# EasyEDA Pro project ProProject_Buck-Boost_1_2024-04-08.epro

# Schematic Schematic1
Create Date: 2024-04-07; Page Name: P1; Project Name: Buck-Boost_1; Schematic Name: Schematic1; Update Date: 2024-04-07; Company: 嘉立创EDA; Page Size: A3; Version: V1.0
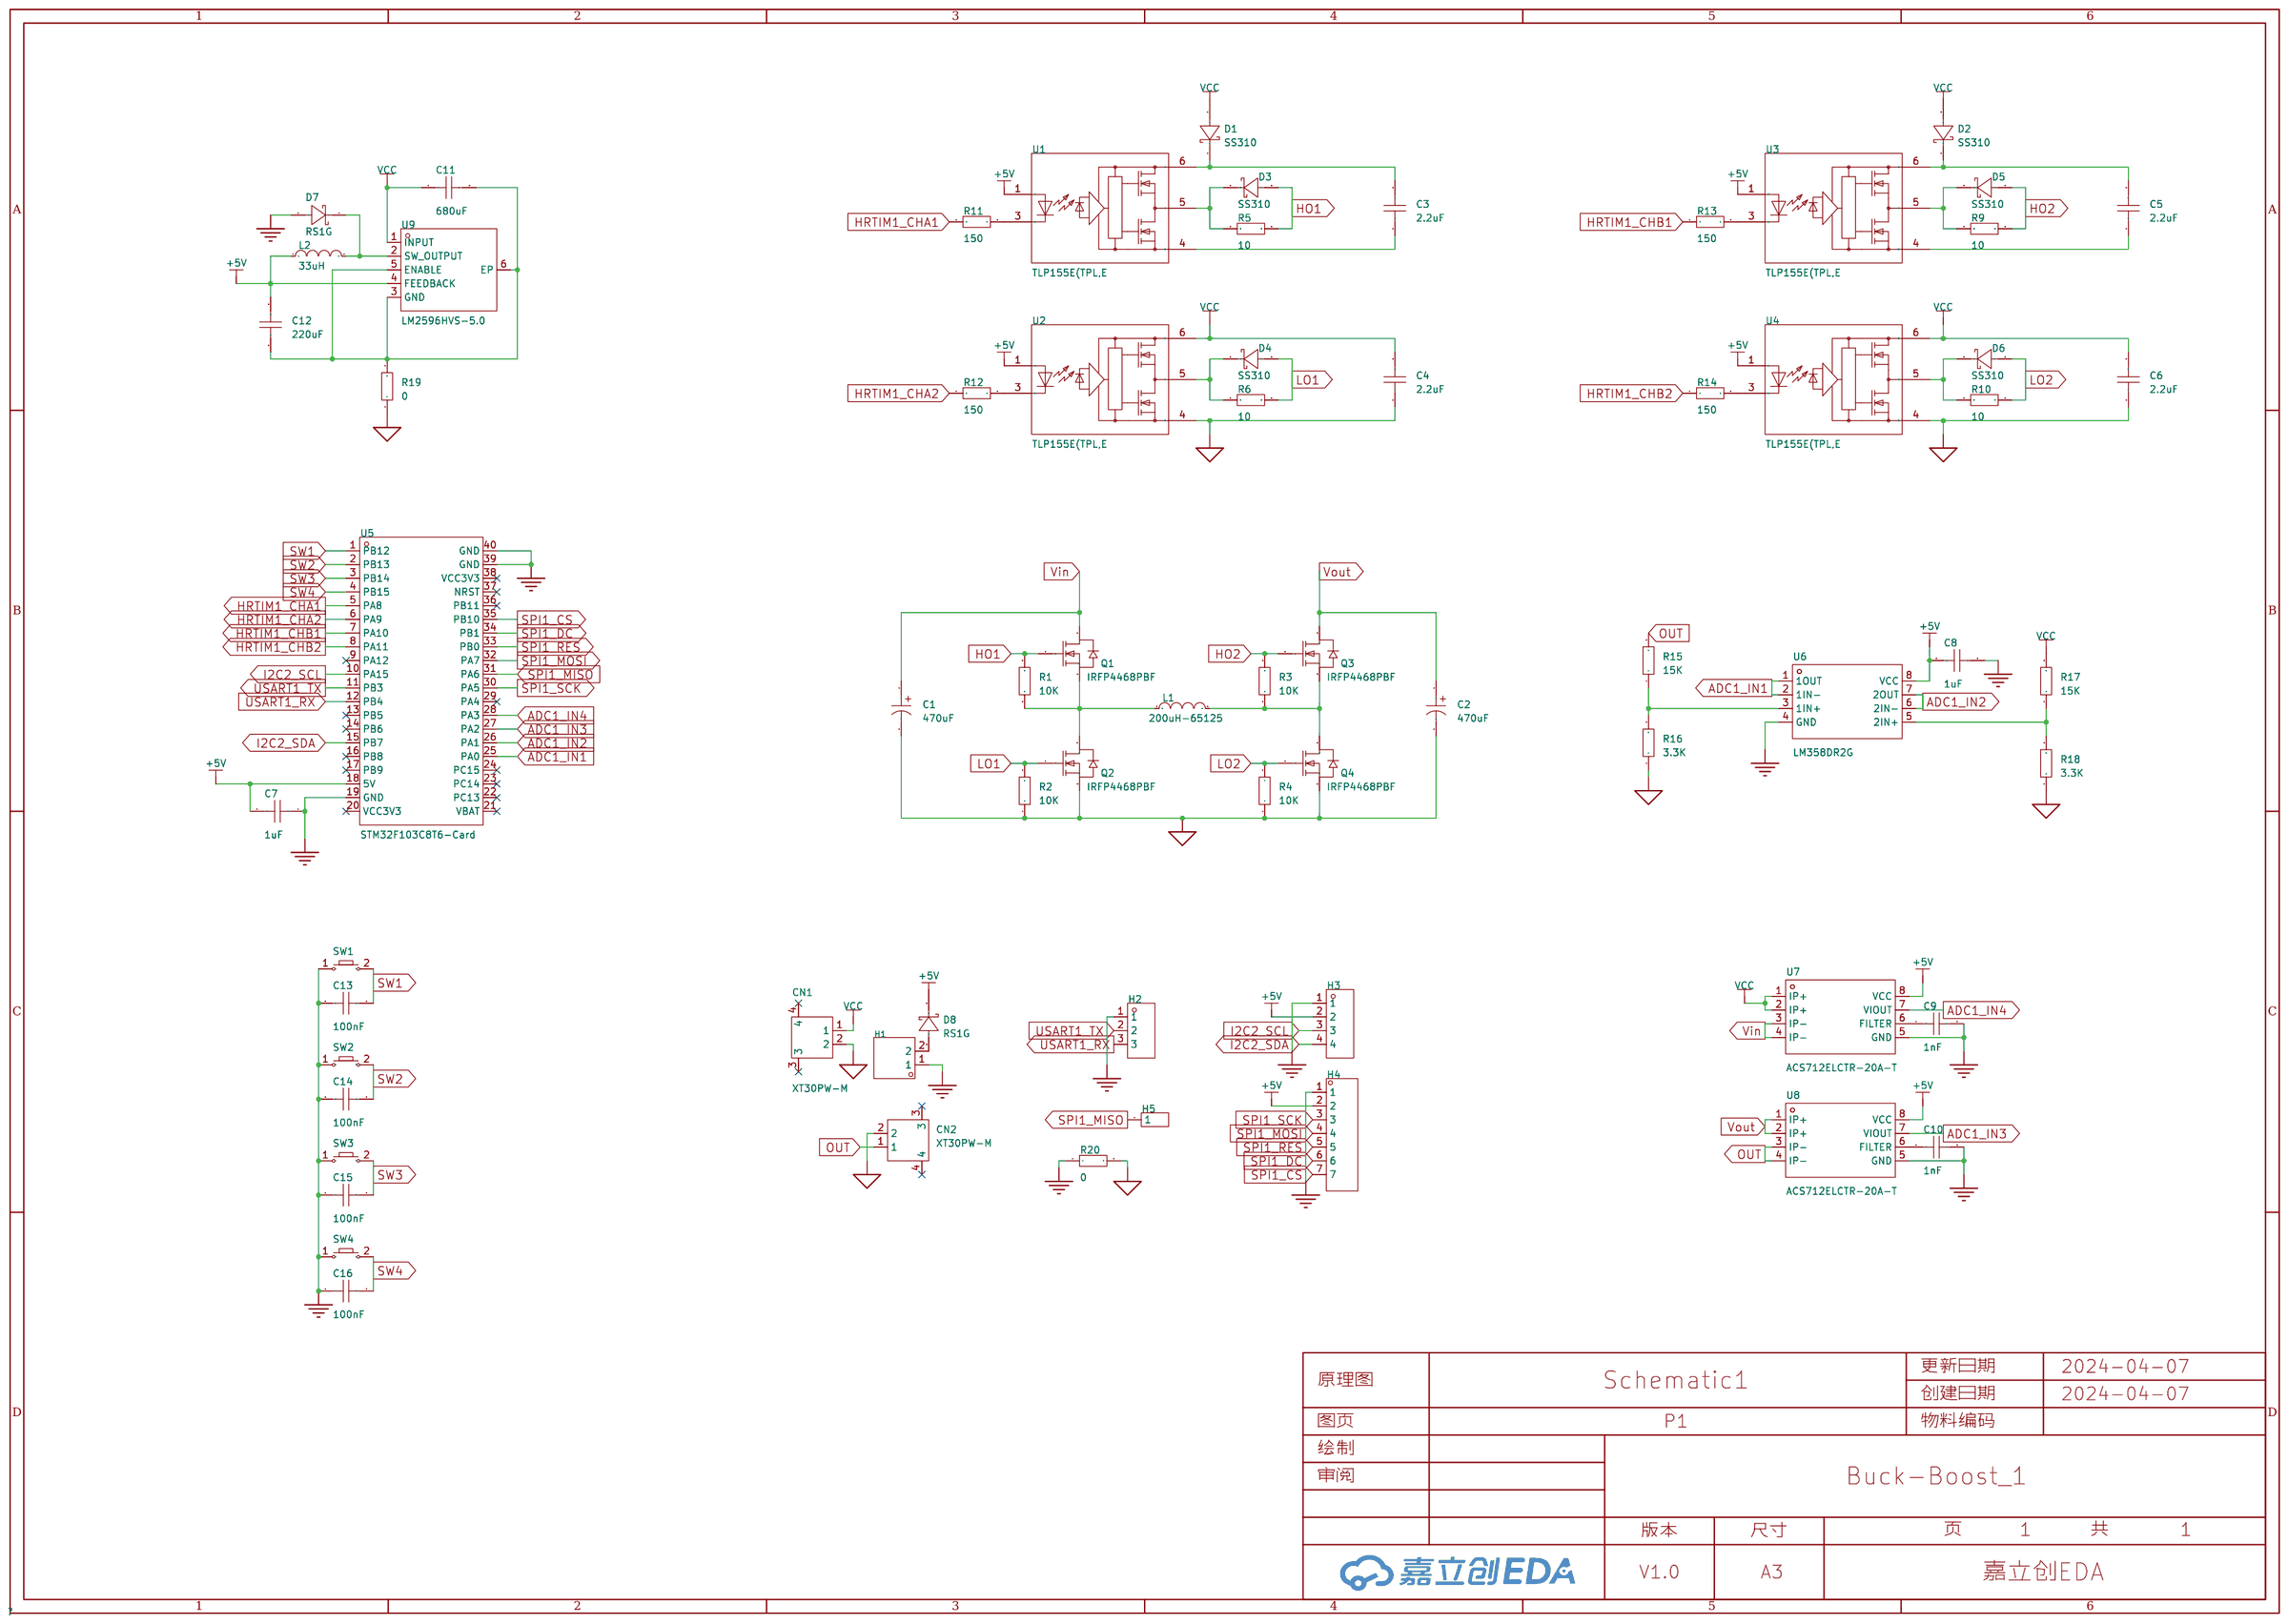
[diagram p0: schematic sheet]

## Parts
C1  470uF  [CAP-TH_BD16.0-P7.50-D1.5-FD]
C2  470uF  [CAP-TH_BD16.0-P7.50-D1.5-FD]
C3  2.2uF  [C0603]
C4  2.2uF  [C0603]
C5  2.2uF  [C0603]
C6  2.2uF  [C0603]
C7  1uF  [C0603]
C8  1uF  [C0603]
C9  1nF  [C0603]
C10  1nF  [C0603]
C11  680uF  [C0603]
C12  220uF  [C0603]
C13  100nF  [C0603]
C14  100nF  [C0603]
C15  100nF  [C0603]
C16  100nF  [C0603]
CN1  XT30PW-M  [CONN-TH_XT30PW-M]
CN2  XT30PW-M  [CONN-TH_XT30PW-M]
D1  SS310  [SMA_L4.3-W2.6-LS5.2-RD]
D2  SS310  [SMA_L4.3-W2.6-LS5.2-RD]
D3  SS310  [SMA_L4.3-W2.6-LS5.2-RD]
D4  SS310  [SMA_L4.3-W2.6-LS5.2-RD]
D5  SS310  [SMA_L4.3-W2.6-LS5.2-RD]
D6  SS310  [SMA_L4.3-W2.6-LS5.2-RD]
D7  RS1G  [SMA_L4.3-W2.6-LS5.0-RD]
D8  RS1G  [SMA_L4.3-W2.6-LS5.0-RD]
H1  -  [HDR-TH_2P-P2.54-V-M-1]
H2  -  [HDR-TH_3P-P2.54-V-M]
H3  -  [HDR-TH_4P-P2.54-V-F]
H4  -  [HDR-TH_7P-P2.54-V-F]
H5  -  [HDR-TH_1P-V-M_XKB_X4611WV-01I-C28D40]
L1  200uH-65125  [IND-TH_200UH-65125]
L2  33uH  [IND-SMD_L7.3-W6.7_TMPA0605SV]
Q1  IRFP4468PBF  [TO-247AC-3_L15.8-W5.0-P5.46-L]
Q2  IRFP4468PBF  [TO-247AC-3_L15.8-W5.0-P5.46-L]
Q3  IRFP4468PBF  [TO-247AC-3_L15.8-W5.0-P5.46-L]
Q4  IRFP4468PBF  [TO-247AC-3_L15.8-W5.0-P5.46-L]
R1  10K  [R0603]
R2  10K  [R0603]
R3  10K  [R0603]
R4  10K  [R0603]
R5  10  [R0603]
R6  10  [R0603]
R9  10  [R0603]
R10  10  [R0603]
R11  150  [R0603]
R12  150  [R0603]
R13  150  [R0603]
R14  150  [R0603]
R15  15K  [R0603]
R16  3.3K  [R0603]
R17  15K  [R0603]
R18  3.3K  [R0603]
R19  0  [R0603]
R20  0  [R0603]
SW1  -  [Key_SMD_3x4x2]
SW2  -  [Key_SMD_3x4x2]
SW3  -  [Key_SMD_3x4x2]
SW4  -  [Key_SMD_3x4x2]
U1  TLP155E(TPL,E  [OPTO-SMD-5_L3.7-W4.6-P1.27-LS7.0-BR]
U2  TLP155E(TPL,E  [OPTO-SMD-5_L3.7-W4.6-P1.27-LS7.0-BR]
U3  TLP155E(TPL,E  [OPTO-SMD-5_L3.7-W4.6-P1.27-LS7.0-BR]
U4  TLP155E(TPL,E  [OPTO-SMD-5_L3.7-W4.6-P1.27-LS7.0-BR]
U5  STM32F103C8T6-Card  [CONN-TH_L53.3-W22.9_STM32F103C8T6-CARD]
U6  LM358DR2G  [SOIC-8_L5.0-W4.0-P1.27-LS6.0-BL]
U7  ACS712ELCTR-20A-T  [SOIC-8_L4.9-W3.9-P1.27-LS6.0-BL]
U8  ACS712ELCTR-20A-T  [SOIC-8_L4.9-W3.9-P1.27-LS6.0-BL]
U9  LM2596HVS-5.0  [TO-263-5_L10.0-W9.0-P1.70-LS15.0-BL]

## Library data of the parts
C1 C2 = ERS2BM471L35OT: 容值:470uF;精度:±20%;额定电压:120V;纹波电流:-;等效串联电阻:-;; LCSC Part Name: 470uF ±20% 120V; Supplier Part: C724648; Manufacturer: AISHI(艾华集团); Supplier Footprint: 插件,D16xL35mm; JLCPCB Part Class: 扩展库; Datasheet: https://atta.szlcsc.com/upload/public/pdf/source/20191015/C438940_4B8E60A742BB0AE40DDEF87A5C89089D.pdf; Supplier: LCSC; Tolerance: ±20%; Rated Voltage: 120V
C3-C16 = CAP_0603: Supplier Footprint: 0603
CN1 CN2 = XT30PW-M: 类别:-;类型1:-;; LCSC Part Name: AMASS(艾迈斯)航模插头 卧式弯脚 XT30PW-M公头; Supplier Part: C431092; Manufacturer: AMASS(艾迈斯); JLCPCB Part Class: 扩展库; Datasheet: https://atta.szlcsc.com/upload/public/pdf/source/20220222/6A9F22F7850E25B33E1BE430ADF8560B.pdf; Supplier: LCSC; Brand: 艾迈斯; Type: 航模插头; RatedVoltage: DC 500V; InterfaceType: 公头; RatedCurrent: 15A; RecommendedWireGauge: 16/18/20AWG; contact resistance: 1.2mΩ; specifications: 2pin
D1-D6 = SS310_C15874: 正向压降(Vf):850mV@3A;直流反向耐压(Vr):100V;平均整流电流(Io):3A;; LCSC Part Name: 电压:100V 电流:3A; Supplier Part: C15874; Manufacturer: MDD; Supplier Footprint: SMA(DO-214AC); JLCPCB Part Class: Extended Part; Datasheet: https://atta.szlcsc.com/upload/public/pdf/source/20230314/A80AE34493C69B89E2F4B1712F433538.pdf; Supplier: LCSC; Forward Voltage (Vf@If): 850mV@3A; Reverse Voltage (Vr): 100V; Average Rectified Current (Io): 3A; Reverse Leakage Current (Ir): 500uA@100V; Reverse Leakage Current: 5uA; Reverse Recovery Time (trr): 150ns; Operating Temperature: -55℃~+150℃; Diode Configuration: 独立式
D7 D8 = RS1G_C18199117: 二极管配置:独立式;正向压降(Vf):1.3V@1.0A;直流反向耐压(Vr):400V;平均整流电流(Io):1A;反向恢复时间(trr):150ns;; LCSC Part Name: 电压:400V 电流:1A; Supplier Part: C18199117; Manufacturer: 宏迦橙; Supplier Footprint: SMA(DO-214AC); JLCPCB Part Class: Extended Part; Datasheet: https://atta.szlcsc.com/upload/public/pdf/source/20230925/2DA11C666C5D1E1EAD04936CEF3A63C9.pdf; Supplier: LCSC; Diode Configuration: 独立式; Forward Voltage (Vf@If): 1.3V@1.0A; Reverse Voltage (Vr): 400V; Average Rectified Current (Io): 1A; Reverse Leakage Current: 5uA@400V; Reverse Recovery Time (trr): 150ns; Operating Temperature: -55℃~+150℃; Reverse Leakage Current (Ir): 500uA@100V
H1 = HDR-M_2.54_1x2P: Supplier Part: C124375; Supplier Footprint: 插件
H2 = HDR-M_2.54_1x3P: Supplier Part: C2937625; Supplier Footprint: 插件
H3 = HDR-F_2.54_1x4P: Supplier Part: C2718488; Supplier Footprint: 插件
H4 = HDR-F_2.54_1x7P: Supplier Part: C124418; Supplier Footprint: 插件
H5 = HDR-M_2.54_1x1P: Supplier Part: C81276; Supplier Footprint: 插件; JLCPCB Part Class: Extended Part
L1 = 200uH-65125: Supplier Part: C9900012734; Supplier Footprint: IND-TH; JLCPCB Part Class: Extended Part; Supplier: LCSC
L2 = MGV0603330M-10: 电感值:33uH;精度:±20%;额定电流:2A;饱和电流(Isat):2.5A;类型:-;; LCSC Part Name: 33uH ±20% 2.5A; Supplier Part: C2453970; Manufacturer: Laird-Signal Integrity Products; JLCPCB Part Class: Extended Part; Datasheet: https://atta.szlcsc.com/upload/public/pdf/source/20210416/42953FF7012EE029E7A94AFFA1C1F7D2.pdf; Supplier: LCSC; Tolerance: ±20%; Rated Current: 2A; Saturation Current (Isat): 2.5A; DC Resistance (DCR): 200mΩ
Q1-Q4 = IRFP4468PBF: 类型:N沟道;漏源电压(Vdss):100V;连续漏极电流(Id):195A;功率(Pd):520W;导通电阻(RDS(on)@Vgs,Id):2.6mΩ@10V,180A;阈值电压(Vgs(th)@Id):4V@250uA;; LCSC Part Name: N沟道 耐压:100V 电流:195A; Supplier Part: C2919; Manufacturer: Infineon(英飞凌); Supplier Footprint: TO-247AC-3; JLCPCB Part Class: 扩展库; Datasheet: https://atta.szlcsc.com/upload/public/pdf/source/20200421/C513172_0206954A6A294F6A4994DAF9F319B5AC.pdf; Supplier: LCSC; Type: N沟道; Drain Source Voltage (Vdss): 100V; Continuous Drain Current (Id): 195A; Power Dissipation (Pd): 520W; Drain Source On Resistance (RDS(on)@Vgs,Id): 2.6mΩ@10V,180A; Gate Threshold Voltage (Vgs(th)@Id): 4V@250uA; Total Gate Charge (Qg@Vgs): 540nC@10V; Input Capacitance (Ciss@Vds): 19.86nF@50V; Operating Temperature: -55℃~+175℃@(Tj)
R1-R6 R9-R20 = Res_0603: Supplier Footprint: 0603
SW1-SW4 = Key_SMD_3x4x2: Supplier Footprint: SMD
U1-U4 = TLP155E(TPL,E: 输入类型:DC;电源电压:10V~30V;共模瞬变抗扰度CMTI:15kV/us;传播延迟tpLH/tpHL:170ns；170ns;; Supplier Part: C56499; Manufacturer: TOSHIBA(东芝); Supplier Footprint: SOIC-5-4.6mm; JLCPCB Part Class: 扩展库; Datasheet: https://atta.szlcsc.com/upload/public/pdf/source/20150821/1457707350132.pdf; Supplier: LCSC; Input Type: DC; Supply Voltage: 10V~30V; Common Mode Transient Immunity (CMTI): 15kV/us; Propagation Delay tpLH/tpHL: 170ns；170ns; Number of Channels: 1; Operating Temperature: -40℃~+100℃
U5 = STM32F103C8T6-Card: Supplier Part: C9900077949; Supplier Footprint: 插件; Supplier: LCSC
U6 = LM358DR2G: 放大器数:双路;增益带宽积(GBP):1MHz;输入偏置电流(Ib):45nA;压摆率(SR):-;带宽(-3db):-;; LCSC Part Name: LM358DR2G 运算放大器，单电源，双路; Supplier Part: C7950; Manufacturer: onsemi(安森美); Supplier Footprint: SOIC-8; JLCPCB Part Class: 基础库; Datasheet: https://atta.szlcsc.com/upload/public/pdf/source/20150124/1457707258826.pdf; Supplier: LCSC; Number of Circuits: 双路; Gain Bandwidth Product(GBP): 1MHz; Current - Input Bias(Ib): 45nA; Output Current: 40mA; Supply Current: 1.5mA; Operating Temperature: 0℃~+70℃
U7 U8 = ACS712ELCTR-20A-T: 电流测量范围:20A;灵敏度:100mV/A;; Supplier Part: C10681; Manufacturer: ALLEGRO(美国埃戈罗); Supplier Footprint: SOIC-8; JLCPCB Part Class: 扩展库; Datasheet: https://atta.szlcsc.com/upload/public/pdf/source/20130706/1457706622210.pdf; Supplier: LCSC; Current Range: 20A; Supply Voltage: 5V; Sensitivity: 100mV/A; Operating Temperature: -40℃~+85℃
U9 = LM2596HVS-5.0_C18197847: Supplier Part: C18197847; Manufacturer: TECH PUBLIC(台舟); Supplier Footprint: TO-263-5L; Datasheet: https://atta.szlcsc.com/upload/public/pdf/source/20231008/EF2B5CCB8589235E578FFA43C9351D8A.pdf; Supplier: LCSC

## Nets
+5V: C7.2 C8.1 C12.2 D8.1(K) H3.2 H4.2 L2.1 U1.1(AN) U2.1(AN) U3.1(AN) U4.1(AN) U5.18(5V) U6.8(VCC) U7.8(VCC) U8.8(VCC) U9.4(FEEDBACK)
AGND: C1.2 C2.2 C4.1 C6.1 CN1.2 CN2.2 Q2.3(S) Q4.3(S) R2.1 R4.1 R16.1 R18.1 R19.1 R20.2 U2.4(GND) U4.4(GND)
GND: C7.1 C8.2 C9.2 C10.2 C13.1 C14.1 C15.1 C16.1 D7.2(A) H1.1 H2.1 H3.1 H4.1 R20.1 SW1.1 SW2.1 SW3.1 SW4.1 U5.19(GND) U5.39(GND) U5.40(GND) U6.4(GND) U7.5(GND) U8.5(GND)
VCC: C4.2 C6.2 C11.1 CN1.1 D1.2(A) D2.2(A) R17.2 U2.6(VCC) U4.6(VCC) U7.1(IP+) U7.2(IP+) U9.1(INPUT)
Vin: C1.1 Q1.2(D) U7.3(IP-) U7.4(IP-)
ADC1_IN1: U5.25(PA0) U6.1(1OUT) U6.2(1IN-)
ADC1_IN2: U5.26(PA1) U6.6(2IN-) U6.7(2OUT)
ADC1_IN3: U5.27(PA2) U8.7(VIOUT)
ADC1_IN4: U5.28(PA3) U7.7(VIOUT)
HO1: D3.2(A) Q1.1(G) R1.2 R5.2
HO2: D5.2(A) Q3.1(G) R3.2 R9.2
HRTIM1_CHA1: R11.1 U5.5(PA8)
HRTIM1_CHA2: R12.1 U5.6(PA9)
HRTIM1_CHB1: R13.1 U5.7(PA10)
HRTIM1_CHB2: R14.1 U5.8(PA11)
I2C2_SCL: H3.3 U5.10(PA15)
I2C2_SDA: H3.4 U5.15(PB7)
LO1: D4.2(A) Q2.1(G) R2.2 R6.2
LO2: D6.2(A) Q4.1(G) R4.2 R10.2
OUT: CN2.1 R15.2 U8.3(IP-) U8.4(IP-)
SPI1_CS: H4.7 U5.35(PB10)
SPI1_DC: H4.6 U5.34(PB1)
SPI1_MISO: H5.1 U5.31(PA6)
SPI1_MOSI: H4.4 U5.32(PA7)
SPI1_RES: H4.5 U5.33(PB0)
SPI1_SCK: H4.3 U5.30(PA5)
SW1: C13.2 SW1.2 U5.1(PB12)
SW2: C14.2 SW2.2 U5.2(PB13)
SW3: C15.2 SW3.2 U5.3(PB14)
SW4: C16.2 SW4.2 U5.4(PB15)
USART1_RX: H2.3 U5.12(PB4)
USART1_TX: H2.2 U5.11(PB3)
Vout: C2.1 Q3.2(D) U8.1(IP+) U8.2(IP+)
$1N1235: D4.1(K) R6.1 U2.5(VO)
$1N1253: D3.1(K) R5.1 U1.5(VO)
$1N1489: C3.2 D1.1(K) U1.6(VCC)
$1N1495: C3.1 U1.4(GND)
$1N2345: R15.1 R16.2 U6.3(1IN+)
$1N2939: D7.1(K) L2.2 U9.2(SW_OUTPUT)
$1N3865: R11.2 U1.3(CAT)
$1N3891: R12.2 U2.3(CAT)
$1N4391: C9.1 U7.6(FILTER)
$1N4589: R17.1 R18.2 U6.5(2IN+)
$1N4694: C11.2 C12.1 R19.2 U9.3(GND) U9.5(ENABLE) U9.6(EP)
$1N14734: L1.1 Q1.3(S) Q2.2(D) R1.1
$1N15113: L1.2 Q3.3(S) Q4.2(D) R3.1
$1N15576: D6.1(K) R10.1 U4.5(VO)
$1N15577: D5.1(K) R9.1 U3.5(VO)
$1N15582: C5.2 D2.1(K) U3.6(VCC)
$1N15583: C5.1 U3.4(GND)
$1N15585: R13.2 U3.3(CAT)
$1N15586: R14.2 U4.3(CAT)
$1N15724: C10.1 U8.6(FILTER)
$1N19181: D8.2(A) H1.2

Not connected (* = marked no-connect by the designer): CN1 3* 4*; CN2 3* 4*; U5 9(PA12)* 13(PB5)* 14(PB6)* 16(PB8)* 17(PB9)* 20(VCC3V3)* 21(VBAT)* 22(PC13)* 23(PC14)* 24(PC15)* 29(PA4)* 36(PB11)* 37(NRST)* 38(VCC3V3)*

# Board PCB1
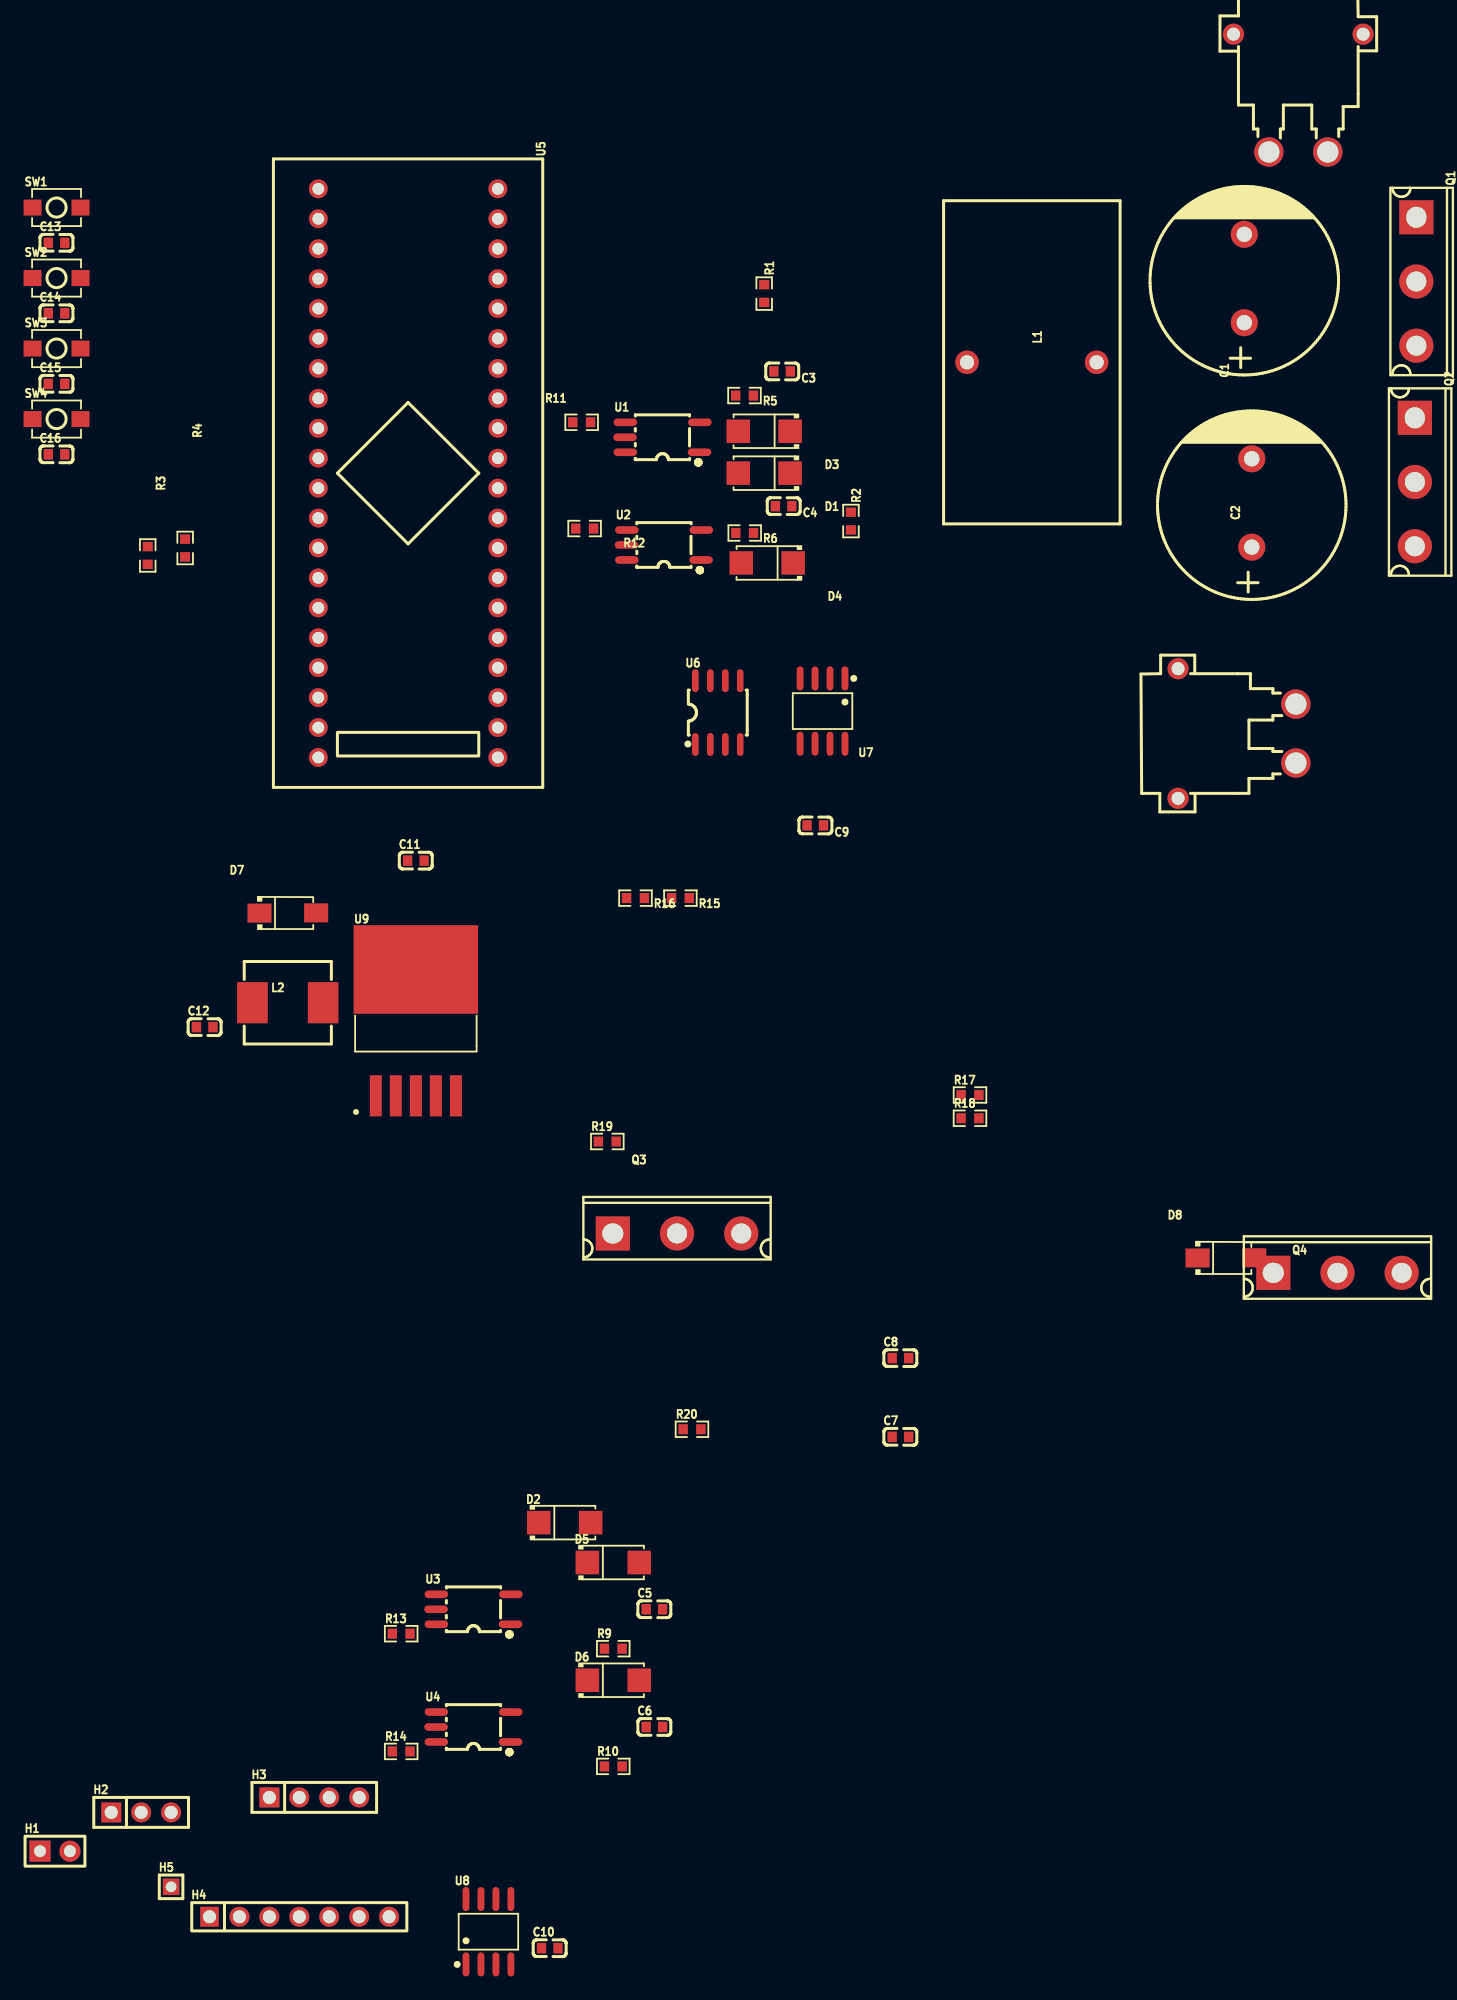
[diagram p1: board, top side]
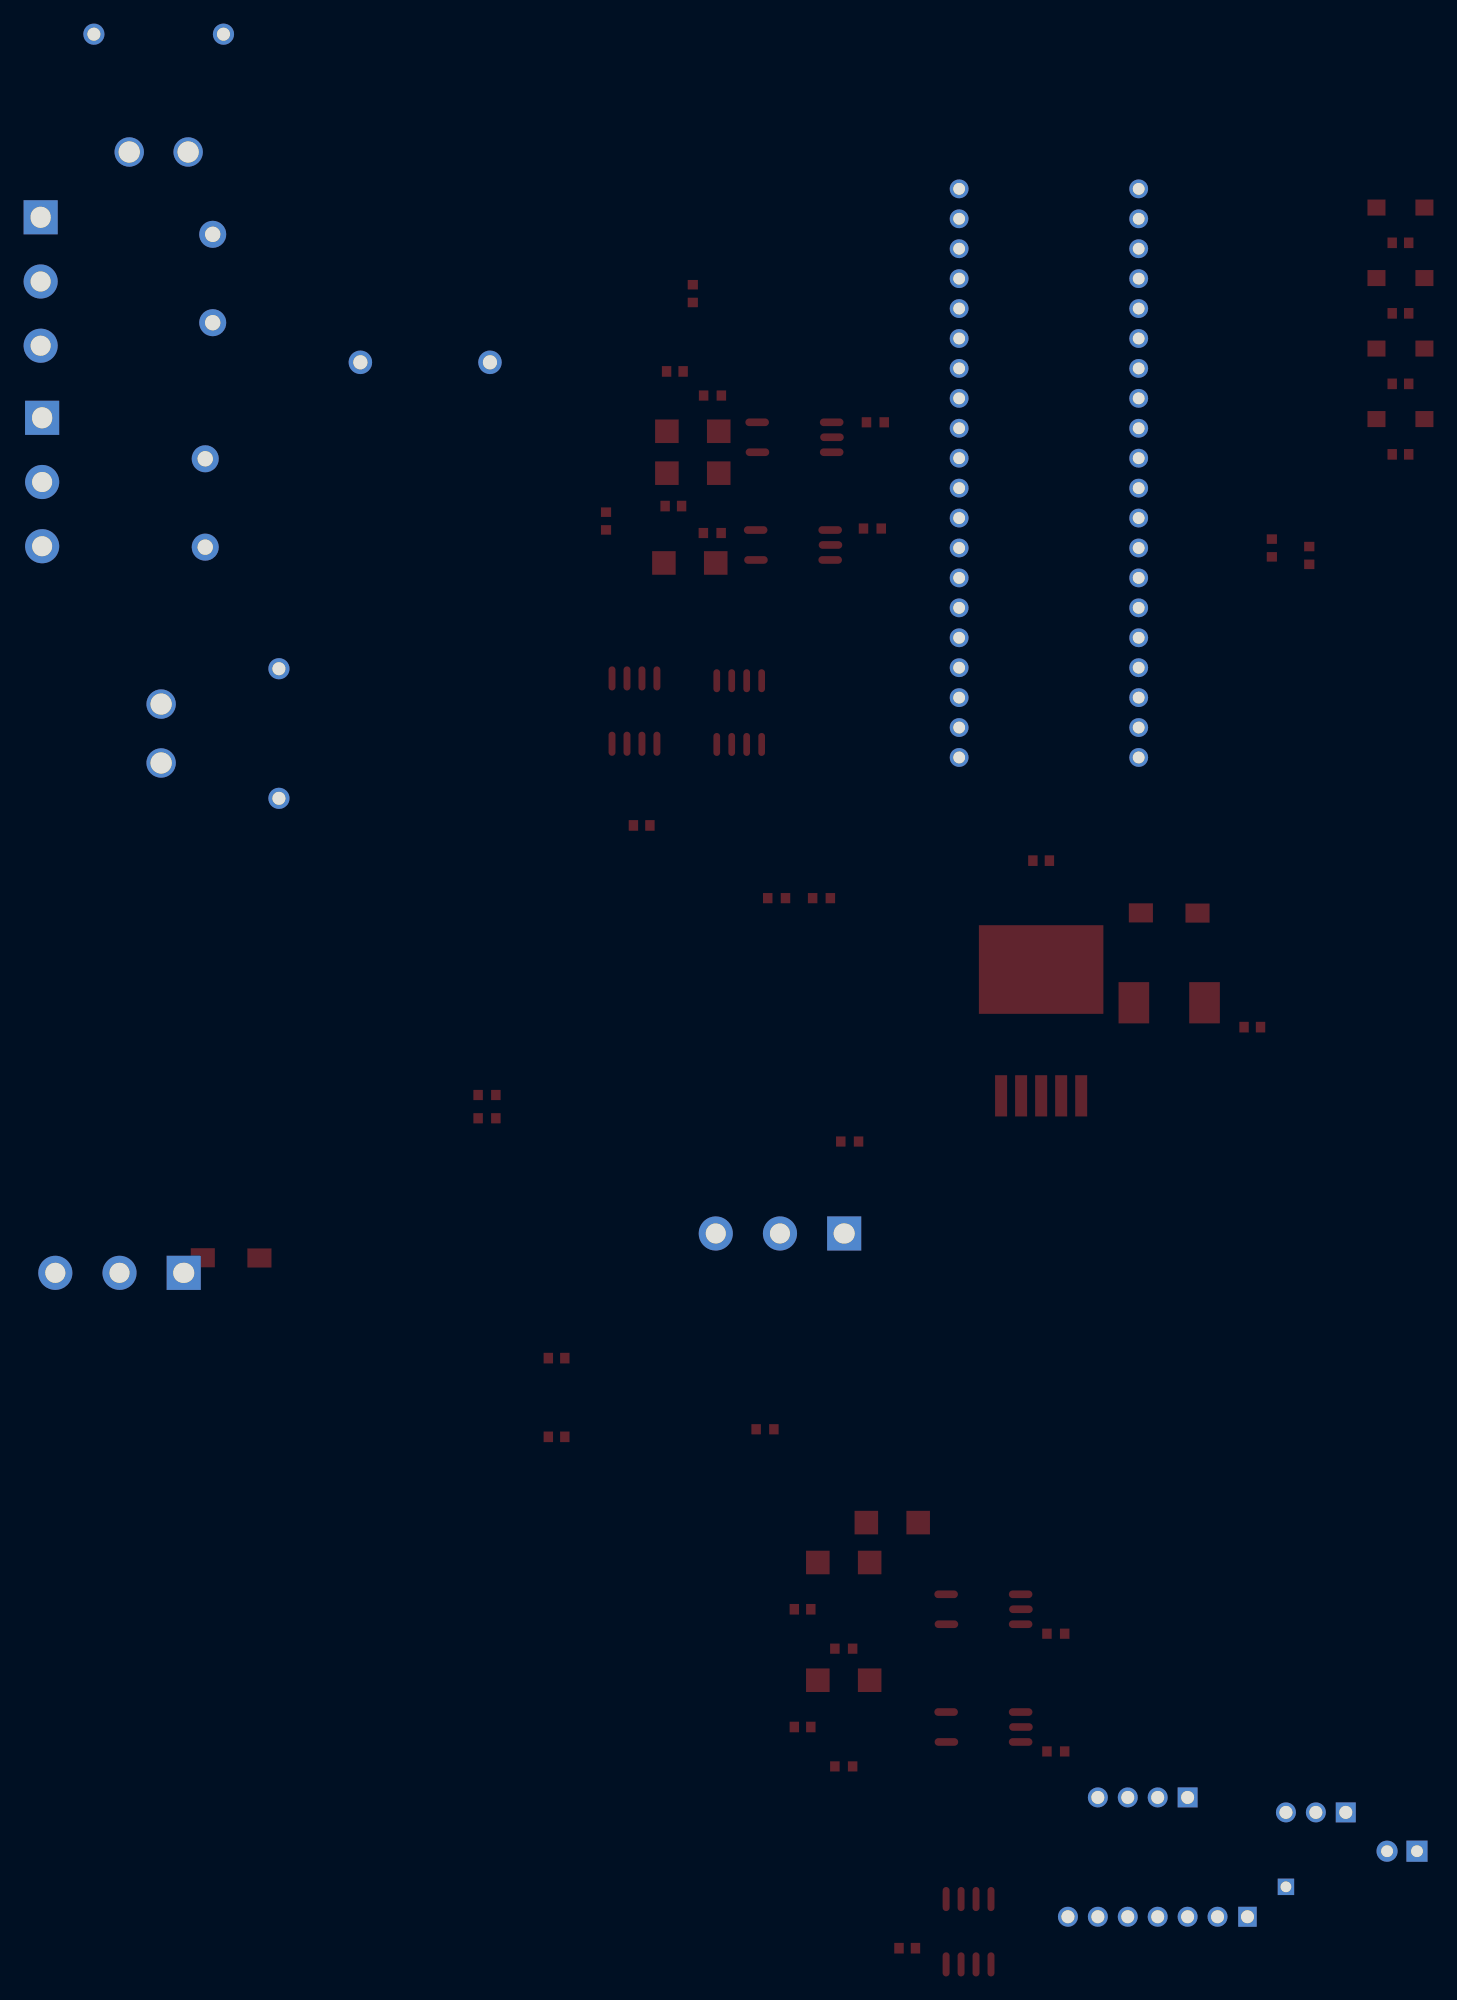
[diagram p2: board, bottom side, seen from below]

No outline. copper layers: Top Layer, Bottom Layer. Coordinates in mm from the lowest, leftmost part position.
Stack: Top Layer 0.035mm / Dielectric1 1.51mm FR4 er 4.5 / Bottom Layer 0.035mm

## Design rules (mm)
template: JLCPCB Capability(Two Layers Board)
spacing copperThickness1oz (default): track to track 0.102, other pairs 0.152 to 0.3
spacing copperThickness2oz: track to track 0.203, other pairs 0.152 to 0.3
track width copperThickness1oz (default): min 0.127, default 0.254, max 2.54
track width copperThickness2oz: min 0.203, default 0.254, max 2.54
differential pair differentialPair (default): width min 0.127, default 0.254, max 2.54; gap min 0.152, default 0.152
via viaSize (default): diameter min 0.5, default 0.61, max 10; hole min 0.3, default 0.305, max 6.3

## Placement (name value [footprint] x y rotation side)
C1  470uF  [CAP-TH_BD16.0-P7.50-D1.5-FD]  100.95 141.71 90 top
C2  470uF  [CAP-TH_BD16.0-P7.50-D1.5-FD]  101.59 122.66 90 top
C3  2.2uF  [C0603]  61.72 133.83 180 top
C4  2.2uF  [C0603]  61.85 122.4 180 top
C5  2.2uF  [C0603]  50.88 28.77 0 top
C6  2.2uF  [C0603]  50.88 18.78 0 top
C7  1uF  [C0603]  71.76 43.4 0 top
C8  1uF  [C0603]  71.76 50.08 0 top
C9  1nF  [C0603]  64.54 95.29 180 top
C10  1nF  [C0603]  42 0 0 top
C11  680uF  [C0603]  30.63 92.3 0 top
C12  220uF  [C0603]  12.71 78.17 0 top
C13  100nF  [C0603]  0.13 144.74 0 top
C14  100nF  [C0603]  0.13 138.75 0 top
C15  100nF  [C0603]  0.13 132.77 0 top
C16  100nF  [C0603]  0.13 126.79 0 top
CN1  XT30PW-M  [CONN-TH_XT30PW-M]  105.54 157.45 180 top
CN2  XT30PW-M  [CONN-TH_XT30PW-M]  100.33 103.09 270 top
D1  SS310  [SMA_L4.3-W2.6-LS5.2-RD]  60.2 125.19 180 top
D2  SS310  [SMA_L4.3-W2.6-LS5.2-RD]  43.27 36.12 0 top
D3  SS310  [SMA_L4.3-W2.6-LS5.2-RD]  60.2 128.75 180 top
D4  SS310  [SMA_L4.3-W2.6-LS5.2-RD]  60.45 117.57 180 top
D5  SS310  [SMA_L4.3-W2.6-LS5.2-RD]  47.39 32.74 0 top
D6  SS310  [SMA_L4.3-W2.6-LS5.2-RD]  47.39 22.74 0 top
D7  RS1G  [SMA_L4.3-W2.6-LS5.0-RD]  19.76 87.86 0 top
D8  RS1G  [SMA_L4.3-W2.6-LS5.0-RD]  99.39 58.59 0 top
H1  -  [HDR-TH_2P-P2.54-V-M-1]  0 8.23 0 top
H2  -  [HDR-TH_3P-P2.54-V-M]  7.31 11.53 0 top
H3  -  [HDR-TH_4P-P2.54-V-F]  22.01 12.8 0 top
H4  -  [HDR-TH_7P-P2.54-V-F]  20.74 2.67 0 top
H5  -  [HDR-TH_1P-V-M_XKB_X4611WV-01I-C28D40]  9.85 5.21 0 top
L1  200uH-65125  [IND-TH_200UH-65125]  82.92 134.6 270 top
L2  33uH  [IND-SMD_L7.3-W6.7_TMPA0605SV]  19.76 80.24 0 top
Q1  IRFP4468PBF  [TO-247AC-3_L15.8-W5.0-P5.46-L]  115.56 141.46 270 top
Q2  IRFP4468PBF  [TO-247AC-3_L15.8-W5.0-P5.46-L]  115.43 124.44 270 top
Q3  IRFP4468PBF  [TO-247AC-3_L15.8-W5.0-P5.46-L]  52.8 60.66 0 top
Q4  IRFP4468PBF  [TO-247AC-3_L15.8-W5.0-P5.46-L]  108.86 57.32 0 top
R1  10K  [R0603]  60.2 140.43 270 top
R2  10K  [R0603]  67.56 121.13 270 top
R3  10K  [R0603]  7.87 118.21 270 top
R4  10K  [R0603]  11.05 118.84 270 top
R5  10  [R0603]  58.53 131.78 180 top
R6  10  [R0603]  58.55 120.11 180 top
R9  10  [R0603]  47.39 25.42 0 top
R10  10  [R0603]  47.39 15.43 0 top
R11  150  [R0603]  44.7 129.51 0 top
R12  150  [R0603]  44.96 120.49 180 top
R13  150  [R0603]  29.39 26.69 0 top
R14  150  [R0603]  29.39 16.7 0 top
R15  15K  [R0603]  53.09 89.12 180 top
R16  3.3K  [R0603]  49.28 89.12 180 top
R17  15K  [R0603]  77.67 72.41 0 top
R18  3.3K  [R0603]  77.67 70.44 0 top
R19  0  [R0603]  46.88 68.47 0 top
R20  0  [R0603]  54.07 44.04 0 top
SW1  -  [Key_SMD_3x4x2]  0.13 147.73 0 top
SW2  -  [Key_SMD_3x4x2]  0.13 141.75 0 top
SW3  -  [Key_SMD_3x4x2]  0.13 135.77 0 top
SW4  -  [Key_SMD_3x4x2]  0.13 129.78 0 top
U1  TLP155E(TPL,E  [OPTO-SMD-5_L3.7-W4.6-P1.27-LS7.0-BR]  51.56 128.24 0 top
U2  TLP155E(TPL,E  [OPTO-SMD-5_L3.7-W4.6-P1.27-LS7.0-BR]  51.69 119.09 0 top
U3  TLP155E(TPL,E  [OPTO-SMD-5_L3.7-W4.6-P1.27-LS7.0-BR]  35.52 28.77 0 top
U4  TLP155E(TPL,E  [OPTO-SMD-5_L3.7-W4.6-P1.27-LS7.0-BR]  35.52 18.78 0 top
U5  STM32F103C8T6-Card  [CONN-TH_L53.3-W22.9_STM32F103C8T6-CARD]  29.97 125.19 270 top
U6  LM358DR2G  [SOIC-8_L5.0-W4.0-P1.27-LS6.0-BL]  56.26 104.87 0 top
U7  ACS712ELCTR-20A-T  [SOIC-8_L4.9-W3.9-P1.27-LS6.0-BL]  65.15 105 180 top
U8  ACS712ELCTR-20A-T  [SOIC-8_L4.9-W3.9-P1.27-LS6.0-BL]  36.79 1.4 0 top
U9  LM2596HVS-5.0  [TO-263-5_L10.0-W9.0-P1.70-LS15.0-BL]  30.63 77.7 0 top

## Footprints (pads in the part's own frame, mm; a bottom-side part is the same pattern mirrored in y, then rotated)
C0603
  rect 0.8x0.9 smd: 1(-0.7,0) 2(0.7,0)
CAP-TH_BD16.0-P7.50-D1.5-FD
  round 2.3 hole 1.3: 1(-3.75,0) 2(3.75,0)
CONN-TH_L53.3-W22.9_STM32F103C8T6-CARD
  round 1.6 hole 1: 1(-24.13,-7.62) 2(-21.59,-7.62) 3(-19.05,-7.62) 4(-16.51,-7.62) 5(-13.97,-7.62) 6(-11.43,-7.62) 7(-8.89,-7.62) 8(-6.35,-7.62) 9(-3.81,-7.62) 10(-1.27,-7.62) 11(1.27,-7.62) 12(3.81,-7.62) 13(6.35,-7.62) 14(8.89,-7.62) 15(11.43,-7.62) 16(13.97,-7.62) 17(16.51,-7.62) 18(19.05,-7.62) 19(21.59,-7.62) 20(24.13,-7.62) 21(24.13,7.62) 22(21.59,7.62) 23(19.05,7.62) 24(16.51,7.62) 25(13.97,7.62) 26(11.43,7.62) 27(8.89,7.62) 28(6.35,7.62) 29(3.81,7.62) 30(1.27,7.62) 31(-1.27,7.62) 32(-3.81,7.62) 33(-6.35,7.62) 34(-8.89,7.62) 35(-11.43,7.62) 36(-13.97,7.62) 37(-16.51,7.62) 38(-19.05,7.62) 39(-21.59,7.62) 40(-24.13,7.62)
CONN-TH_XT30PW-M
  round 2.5 hole 1.8: 1(-2.5,5) 2(2.5,5)
  round 1.8 hole 1.1: 3(5.5,-5) 4(-5.5,-5)
HDR-TH_1P-V-M_XKB_X4611WV-01I-C28D40
  rect 1.4x1.4 hole 0.9: 1(0,0)
HDR-TH_2P-P2.54-V-M-1
  rect 1.8x1.8 hole 1: 1(-1.27,0)
  round 1.8 hole 1: 2(1.27,0)
HDR-TH_3P-P2.54-V-M
  rect 1.7x1.7 hole 1.1: 1(-2.54,0)
  round 1.7 hole 1.1: 2(0,0) 3(2.54,0)
HDR-TH_4P-P2.54-V-F
  rect 1.7x1.7 hole 1.1: 1(-3.81,0)
  round 1.7 hole 1.1: 2(-1.27,0) 3(1.27,0) 4(3.81,0)
HDR-TH_7P-P2.54-V-F
  rect 1.575x1.7 hole 1.1: 1(-7.62,0)
  round 1.7 hole 1.1: 2(-5.08,0) 3(-2.54,0) 4(0,0) 5(2.54,0) 6(5.08,0) 7(7.62,0)
IND-SMD_L7.3-W6.7_TMPA0605SV
  rect 2.6x3.5 smd: 1(-3,0) 2(3,0)
IND-TH_200UH-65125
  round 2 hole 1.2: 1(0,-5.5) 2(0,5.5)
Key_SMD_3x4x2
  rect 1.53x1.36 smd: 1(-2.035,0) 2(2.035,0)
OPTO-SMD-5_L3.7-W4.6-P1.27-LS7.0-BR
  oval 2x0.65 smd: 1(3.15,-1.27) 3(3.175,1.27) 4(-3.15,1.27) 5(-3.175,0) 6(-3.15,-1.27)
R0603
  rect 0.806x0.864 smd: 1(-0.753,0) 2(0.753,0)
SMA_L4.3-W2.6-LS5.0-RD
  rect 2.046x1.62 smd: 1(-2.404,-0.009) 2(2.404,0.009)
SMA_L4.3-W2.6-LS5.2-RD
  rect 2x2 smd: 1(-2.2,0) 2(2.2,0)
SOIC-8_L4.9-W3.9-P1.27-LS6.0-BL
  oval 0.588x2.045 smd: 1(-1.905,-2.772) 2(-0.635,-2.772) 3(0.635,-2.772) 4(1.905,-2.772) 5(1.905,2.772) 6(0.635,2.772) 7(-0.635,2.772) 8(-1.905,2.772)
SOIC-8_L5.0-W4.0-P1.27-LS6.0-BL
  oval 0.569x1.95 smd: 1(-1.905,-2.705) 2(-0.635,-2.705) 3(0.635,-2.705) 4(1.905,-2.705) 5(1.905,2.705) 6(0.635,2.705) 7(-0.635,2.705) 8(-1.905,2.705)
TO-247AC-3_L15.8-W5.0-P5.46-L
  rect 2.9x2.9 hole 1.785x1.7: 1(-5.45,0)
  round 2.9 hole 1.7: 2(0,0) 3(5.45,0)
TO-263-5_L10.0-W9.0-P1.70-LS15.0-BL
  rect 1.02x3.5 smd: 1(-3.4,-5.36) 2(-1.7,-5.36) 3(0,-5.36) 4(1.7,-5.36) 5(3.4,-5.36)
  rect 10.566x7.521 smd: 6(0,5.36)

## Nets
As in the schematic, except:
VIN: C1.1 Q1.2 U7.3 U7.4
VOUT: C2.1 Q3.2 U8.1 U8.2

Pads without a net: CN1 3 4; CN2 3 4; U5 9 13 14 16 17 20 21 22 23 24 29 36 37 38
